# EAGLE schematic TPS62745 (EAGLE 9.6.2)
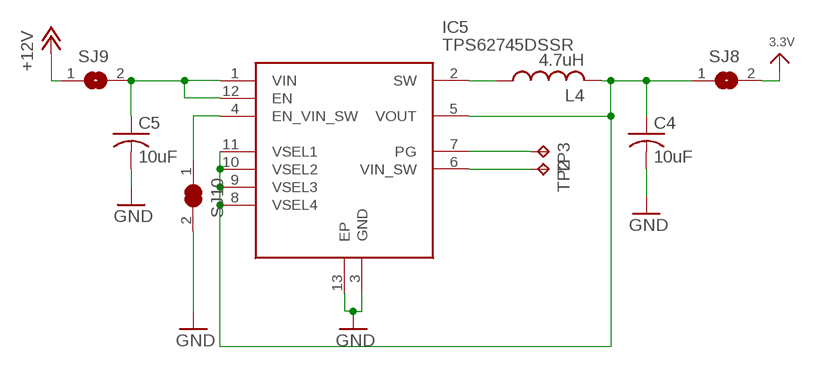
[diagram p0: schematic, sheet 1]

## Parts
C4  10uF  C-USC3216  [C3216]
C5  10uF  C-USC3216  [C3216]
IC5  TPS62745DSSR  [SON50P200X300X80-13N]
L4  4.7uH  L-USL1210  [L1210]
SJ8  SJ  [SJ]
SJ9  SJ  [SJ]
SJ10  SOLDERJUMPER_CLOSED  [SOLDERJUMPER_CLOSEDWIRE]
TP2  TPTP08R  [TP08R]
TP3  TPTP08R  [TP08R]

## Nets
3.3V: SJ8.2
+12V: SJ9.1
GND: C4.2 C5.2 IC5.3(GND) IC5.13(EP) SJ10.2
N$5: IC5.2(SW) L4.1
N$15: C4.1 IC5.5(VOUT) IC5.8(VSEL4) IC5.9(VSEL3) IC5.10(VSEL2) IC5.11(VSEL1) L4.2 SJ8.1
N$16: C5.1 IC5.1(VIN) IC5.12(EN) SJ9.2
N$17: IC5.7(PG) TP3.TP
N$18: IC5.6(VIN_SW) TP2.TP
N$19: IC5.4(EN_VIN_SW) SJ10.1

## Library data of the parts
C4 C5 = adafruit:C-US: CAPACITOR, American symbol
IC5 = SamacSys_Parts:TPS62745DSSR: 3.3V-10V input, 300mA Ultra Low Iq step-down converter with VSEL and input voltage switch Source: Datasheet <http://www.ti.com/lit/gpn/tps62745>; DESCRIPTION: 3.3V-10V input, 300mA Ultra Low Iq step-down converter with VSEL and input voltage switch; HEIGHT: 0.8mm; MANUFACTURER_NAME: Texas Instruments; MANUFACTURER_PART_NUMBER: TPS62745DSSR; MOUSER_PART_NUMBER: 595-TPS62745DSSR; MOUSER_PRICE-STOCK: https://www.mouser.co.uk/ProductDetail/Texas-Instruments/TPS62745DSSR?qs=cGEy3R83DS9Bx52nwzd43Q%3D%3D
L4 = rcl-2:L-US: INDUCTOR, American symbol
SJ8 SJ9 = jumper:SJ: SMD solder JUMPER
SJ10 = microbuilder:SOLDERJUMPER_CLOSED: Solder Jumper - Closed These solder jumpers are closed by default CLOSEDWIRE - 10 mil trace between pads that can be cut and resoldered later CLOSEDPERM - 63 mil trace between pads for a permanent connection (used to 'bridge' two signals, a shameless hack for Eagle). Can double as a test point as well (no cream layer)
TP2 TP3 = testpad:TP: Test pad